# EAGLE design H1DR10 (EAGLE 9.5.1)

## Sheet 1 of 2
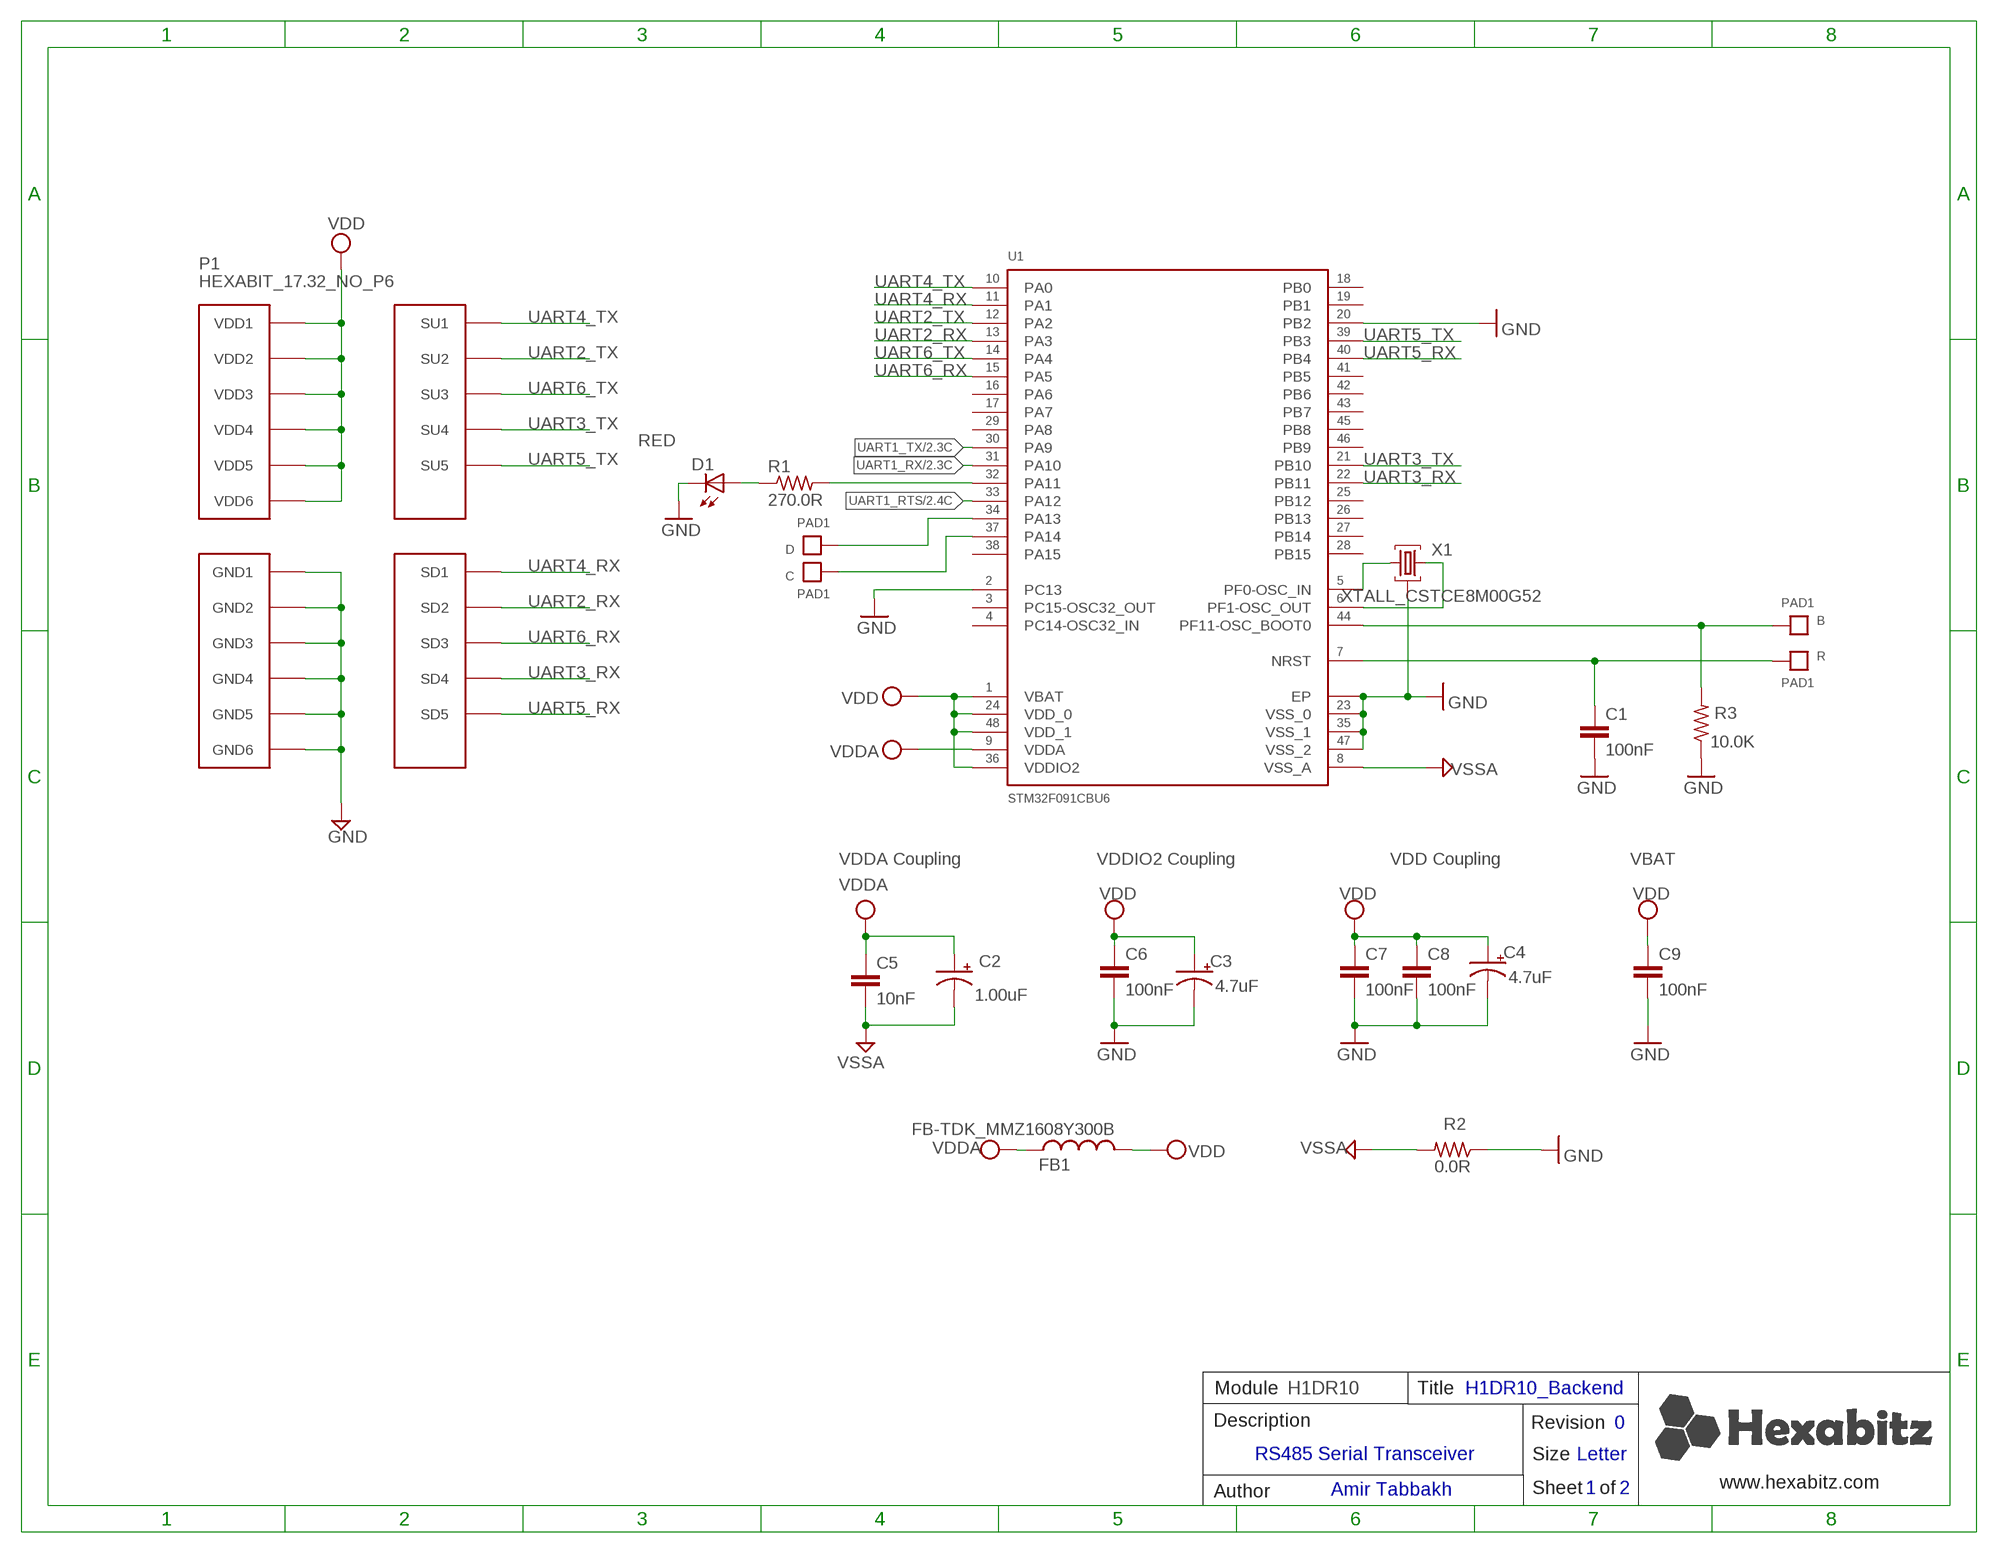
[diagram p0: schematic, sheet 1]

### Parts
B  PAD1  [PAD1]
C  PAD1  [PAD1]
C1  100nF  C-0603  [C-0603]
C2  1.00uF  C-0805-POL  [C-0805-POL]
C3  4.7uF  C-0805-POL  [C-0805-POL]
C4  4.7uF  C-0805-POL  [C-0805-POL]
C5  10nF  C-0603  [C-0603]
C6  100nF  C-0603  [C-0603]
C7  100nF  C-0603  [C-0603]
C8  100nF  C-0603  [C-0603]
C9  100nF  C-0603  [C-0603]
D  PAD1  [PAD1]
D1  RED  VLMS1300-GS08  [VLMS1300-GS08]
FB1  FB-TDK_MMZ1608Y300B  [FB-TDK_MMZ1608Y300B]
P1  HEXABIT_17.32_NO_P6  [HEXABIT_17.32_NO_P6]
R  PAD1  [PAD1]
R1  270.0R  R-0603  [R-0603]
R2  0.0R  R-0603  [R-0603]
R3  10.0K  R-0603  [R-0603]
U1  STM32F091CBU6  [STM32F091CBU6]
X1  XTALL_CSTCE8M00G52  [XTALL_CSTCE8M00G52]

### Nets
B1: B.P$1 B.P$2 R3.2 U1.P$44(PF11-OSC_BOOT0)
GND: C1.2 C3.2(-) C4.2(-) C6.2 C7.2 C8.2 C9.2 D1.C P1.PAD_PD7(GND1) P1.PAD_PD8(GND2) P1.PAD_PD9(GND3) P1.PAD_PD10(GND4) P1.PAD_PD11(GND5) P1.PAD_PD12(GND6) R2.1 R3.1 U1.EP U1.P$2(PC13) U1.P$20(PB2) U1.P$23(VSS_0) U1.P$35(VSS_1) U1.P$47(VSS_2) X1.P$2 ; also sheet 2
N$1: D.P$1 D.P$2 U1.P$34(PA13)
N$3: R1.2 U1.P$32(PA11)
N$4: D1.A R1.1
N$5: U1.P$5(PF0-OSC_IN) X1.P$1
N$6: U1.P$6(PF1-OSC_OUT) X1.P$3
N$9: C.P$1 C.P$2 U1.P$37(PA14)
R1: C1.1 R.P$1 R.P$2 U1.P$7(NRST)
UART1_RTS: U1.P$33(PA12) ; also sheet 2
UART1_RX: U1.P$31(PA10) ; also sheet 2
UART1_TX: U1.P$30(PA9) ; also sheet 2
UART2_RX: P1.PAD_PD2(SD2) U1.P$13(PA3)
UART2_TX: P1.PAD_PU2(SU2) U1.P$12(PA2)
UART3_RX: P1.PAD_PD4(SD4) U1.P$22(PB11)
UART3_TX: P1.PAD_PU4(SU4) U1.P$21(PB10)
UART4_RX: P1.PAD_PD1(SD1) U1.P$11(PA1)
UART4_TX: P1.PAD_PU1(SU1) U1.P$10(PA0)
UART5_RX: P1.PAD_PD5(SD5) U1.P$40(PB4)
UART5_TX: P1.PAD_PU5(SU5) U1.P$39(PB3)
UART6_RX: P1.PAD_PD3(SD3) U1.P$15(PA5)
UART6_TX: P1.PAD_PU3(SU3) U1.P$14(PA4)
VDD: C3.1(+) C4.1(+) C6.1 C7.1 C8.1 C9.1 FB1.2 P1.PAD_PU7(VDD1) P1.PAD_PU8(VDD2) P1.PAD_PU9(VDD3) P1.PAD_PU10(VDD4) P1.PAD_PU11(VDD5) P1.PAD_PU12(VDD6) U1.P$1(VBAT) U1.P$24(VDD_0) U1.P$36(VDDIO2) U1.P$48(VDD_1) ; also sheet 2
VDDA: C2.1(+) C5.1 FB1.1 U1.P$9(VDDA)
VSSA: C2.2(-) C5.2 R2.2 U1.P$8(VSS_A)
Unconnected: U1.P$3(PC14-OSC32_IN) U1.P$4(PC15-OSC32_OUT) U1.P$16(PA6) U1.P$17(PA7) U1.P$18(PB0) U1.P$19(PB1) U1.P$25(PB12) U1.P$26(PB13) U1.P$27(PB14) U1.P$28(PB15) U1.P$29(PA8) U1.P$38(PA15) U1.P$41(PB5) U1.P$42(PB6) U1.P$43(PB7) U1.P$45(PB8) U1.P$46(PB9)

### Notes on the sheet
- VDDA Coupling | VDDIO2 Coupling | VDD Coupling | VBAT
- Module | H1DR10 | Title | H1DR10_Backend
- Description | Revision | 0
- RS485 Serial Transceiver
- Size | Letter
- Amir Tabbakh | www.hexabitz.com
- Author | Sheet   of | 1 | 2
- C:/Users/Admin/Desktop/logodraft.bmp

## Sheet 2 of 2
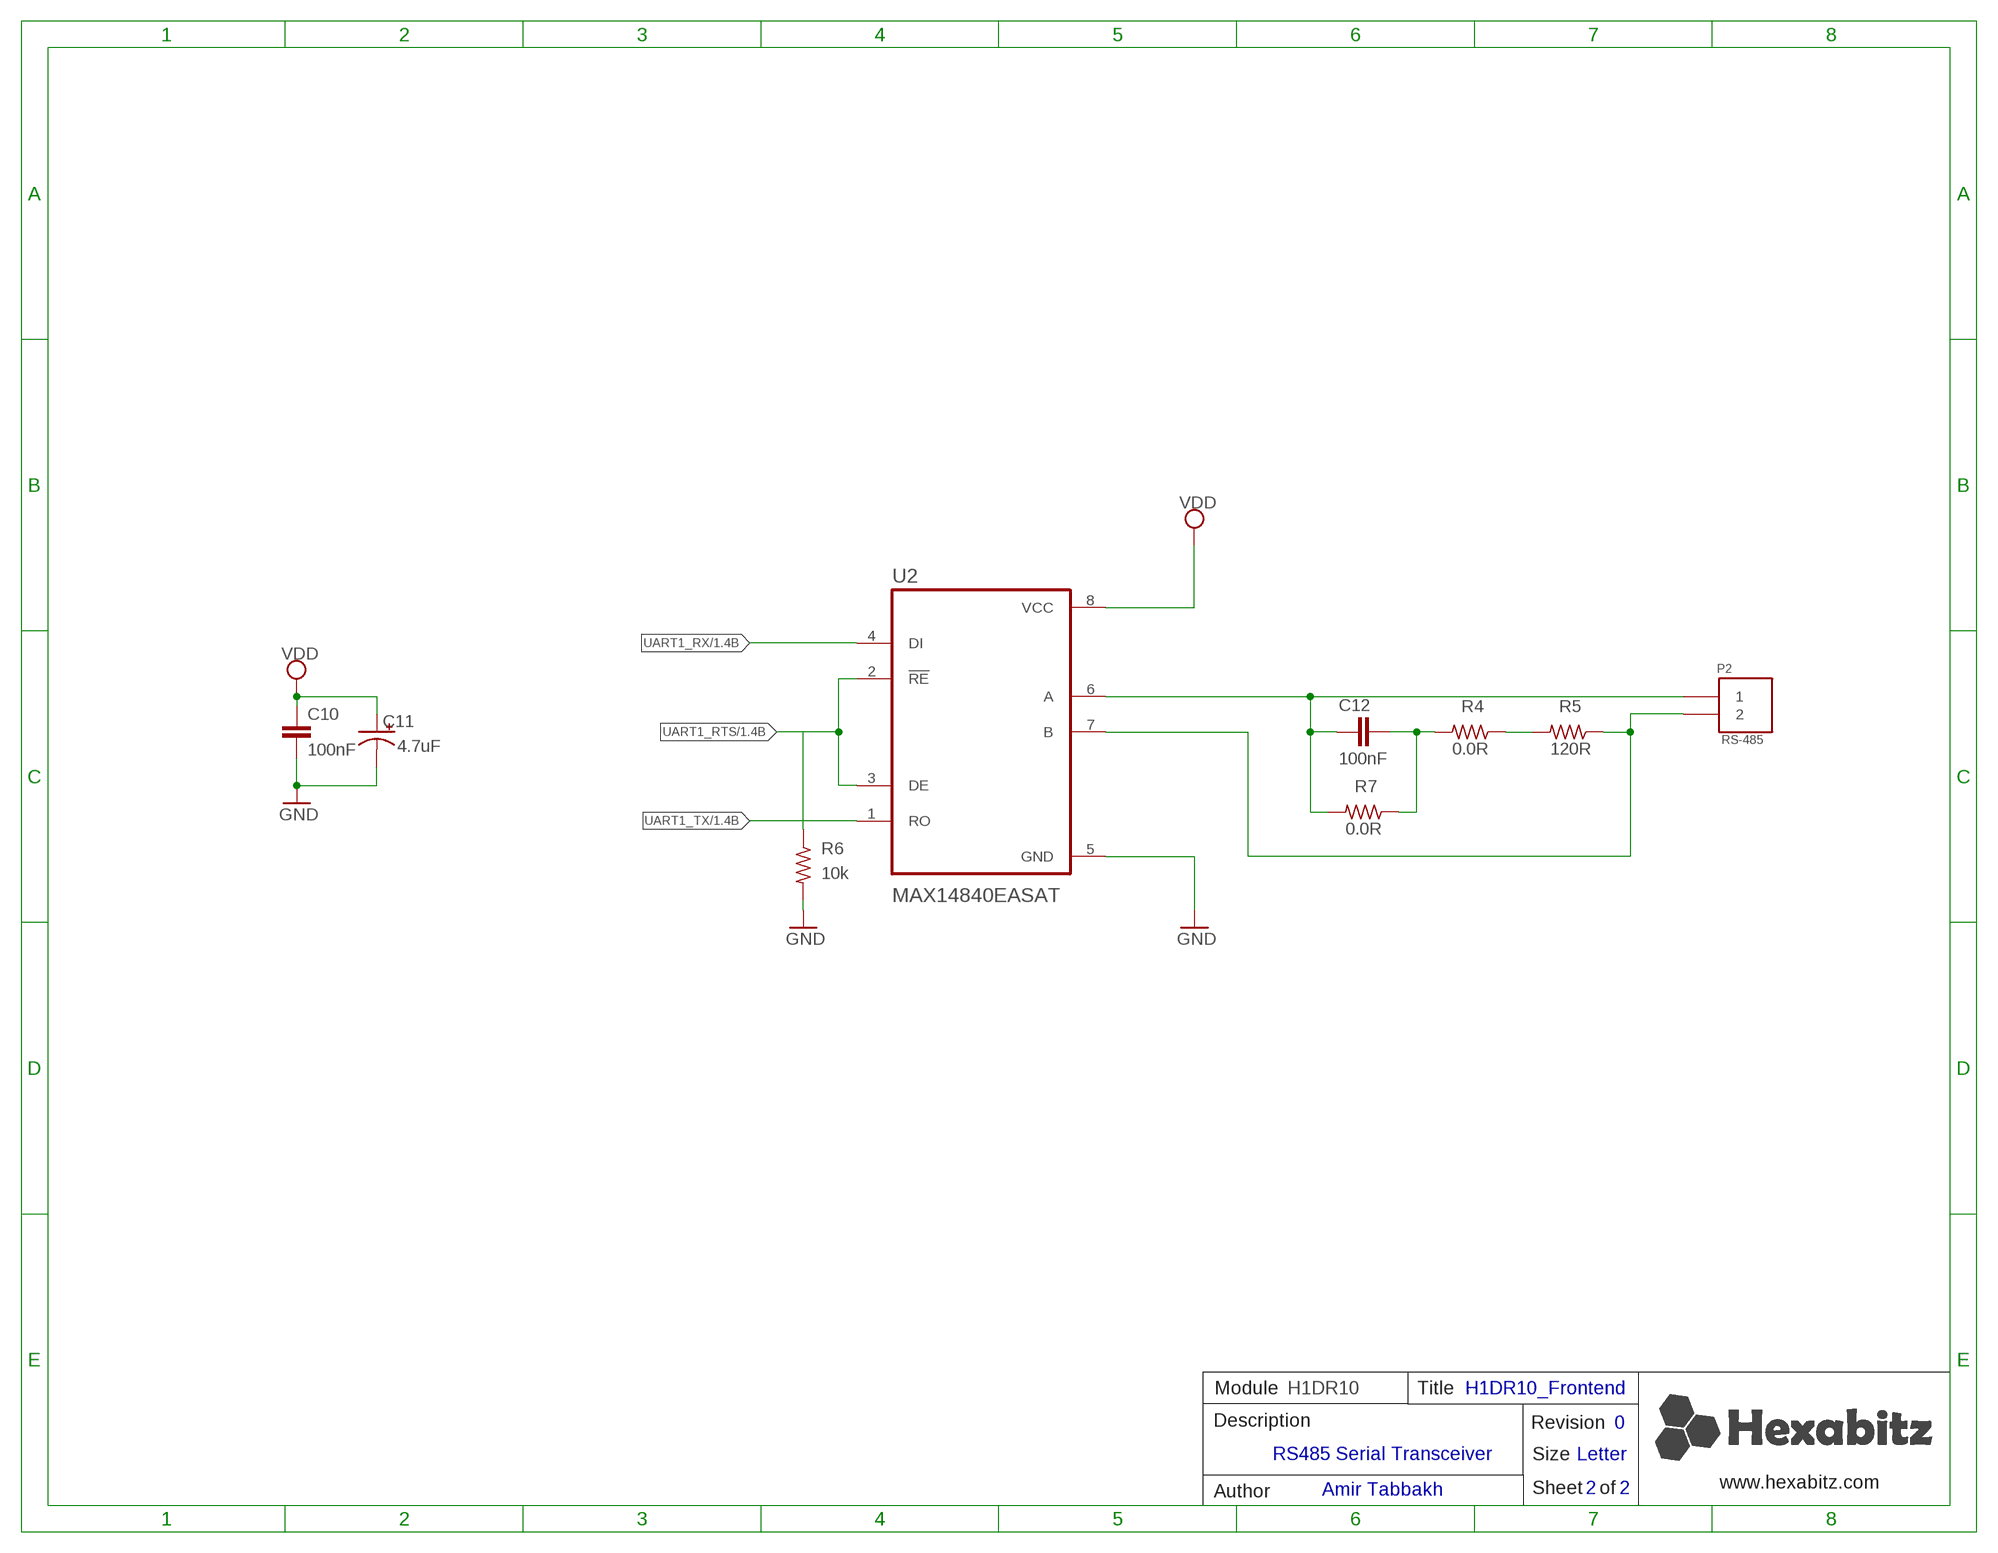
[diagram p1: schematic, sheet 2]

### Parts
C10  100nF  C-0603  [C-0603]
C11  4.7uF  C-0805-POL  [C-0805-POL]
C12  100nF  C-0603  [C-0603]
P2  RS-485  1546111-2  [1546111-2]
R4  0.0R  R-0603  [R-0603]
R5  120R  R-0805  [R-0805]
R6  10k  R-0603  [R-0603]
R7  0.0R  R-0603  [R-0603]
U2  MAX14840EASAT  [SOIC127P600X175-8N]

### Nets
GND: C10.2 C11.2(-) R6.2 U2.5(GND) ; also sheet 1
N$2: C12.2 R4.2 R7.1
N$7: P2.2 R5.1 U2.7(B)
N$8: C12.1 P2.1 R7.2 U2.6(A)
N$10: R4.1 R5.2
UART1_RTS: R6.1 U2.2(!RE) U2.3(DE) ; also sheet 1
UART1_RX: U2.4(DI) ; also sheet 1
UART1_TX: U2.1(RO) ; also sheet 1
VDD: C10.1 C11.1(+) U2.8(VCC) ; also sheet 1

### Notes on the sheet
- Module | H1DR10 | Title | H1DR10_Frontend
- Description | Revision | 0
- RS485 Serial Transceiver
- Size | Letter
- Amir Tabbakh | www.hexabitz.com
- Author | Sheet   of | 2 | 2

## Library data of the parts
B C D R = Hexabitz:PAD1
C1 C6 C8 C10 = Hexabitz:C-0603: CAP CER 10% X7R 0603; CAPACITANCE: 100nF; MFN: KEMET; MPN: C0603C104K8RACTU; OCTOPART_URL: https://octopart.com/c0603c104k8ractu-kemet-145075?r=sp&s=9bS9ASSwSEqMCE9KBEQZ0g; TOLERANCE: 10%; VOLTAGE_RATING: 10V
C2 = Hexabitz:C-0805-POL: Cap Tant Solid SMD 2012; CAPACITANCE: 1.00uF; MFN: Yageo; MPN: CC0805KKX7R7BB105; OCTOPART_URL: https://octopart.com/cc0805kkx7r7bb105-yageo-8376555?r=sp&s=YKl1wwtkROau_X5nniH2ig; TOLERANCE: 10%; VOLTAGE_RATING: 16V
C3 C4 C11 = Hexabitz:C-0805-POL: Cap Tant Solid SMD 2012; CAPACITANCE: 4.7uF; MFN: Murata; MPN: GRM21BC81E475KA12L; OCTOPART_URL: https://octopart.com/grm21bc81e475ka12l-murata-10331911?r=sp&s=RY3qZSD8T6mG6TC9CHI5qQ; TOLERANCE: 10%; VOLTAGE_RATING: 25V
C5 = Hexabitz:C-0603: CAP CER 10% X7R 0603; CAPACITANCE: 10nF; MFN: KEMET; MPN: C0603C103K5RACTU; OCTOPART_URL: https://octopart.com/c0603c103k5ractu-kemet-133094?r=sp&s=R_iPBxLnSmGqhkU2rIMFpg; TOLERANCE: 10%; VOLTAGE_RATING: 50V
C7 = Hexabitz:C-0603: CAP CER 10% X7R 0603; CAPACITANCE: 100nF; MFN: KEMET; MPN: C0603C104K8RACTU; OCTOPART_URL: https://octopart.com/c0603c104k8ractu-kemet-145075?r=sp&s=9bS9ASSwSEqMCE9KBEQZ0g; TOLERANCE: 10%; VOLTAGE_RATING: 10
C9 = Hexabitz:C-0603: CAP CER 10% X7R 0603; CAPACITANCE: 100nF; MFN: KEMET; MPN: C0603C104K8RACTU; OCTOPART_URL: https://octopart.com/c0603c104k8ractu-kemet-145075?r=sp&s=9bS9ASSwSEqMCE9KBEQZ0g; TOLERANCE: 10V; VOLTAGE_RATING: 10%
C12 = Hexabitz:C-0603: CAP CER 10% X7R 0603; CAPACITANCE: 100nF; MFN: AVX; MPN: 0603YC104K4T2A; OCTOPART_URL: https://octopart.com/0603yc104k4t2a-avx+interconnect+%2F+elco-8120651; TOLERANCE: 10%; VOLTAGE_RATING: 16V
D1 = Hexabitz:VLMS1300-GS08: Red 0603 130° Clear 54 mcd 2 V Surface Mount ChipLED ; Octopart Url : http://octopart.com/vlms1300-gs08-vishay-21709201; MFN: Vishay; MPN: VLMS1300-GS08; OCTOPART_URL: https://octopart.com/vlms1300-gs08-vishay-21709201?r=sp&s=_gcP4_q8T1SC6PJQPTQ9yA
FB1 = Hexabitz:FB-TDK_MMZ1608Y300B: Ferrite Beads Multi-Layer 30Ohm 25% 100MHz 1.5A 50mOhm DCR 0603; MFN: TDK; MPN: MMZ1608Y300B; OCTOPART_URL: https://octopart.com/mmz1608y300b-tdk-368280?r=sp&s=cd9_2ZEqQ9q9UNBuQgHAiA
P1 = hexabitz_connectors:HEXABIT_?_NO_P6: Hexabitz Hexagon Module Connector Hexagon side length = 17.32mm. The following ports are removed: P6
P2 = Hexabitz:1546111-2: Conn Shrouded Header HDR 2 POS 5.08mm Solder ST Thru-Hole; MFN: TE Connectivity; MPN: 1546111-2; OCTOPART_URL: https://octopart.com/1546111-2-te+connectivity-40393355
R1 = Hexabitz:R-0603: Thick Film Resistors - SMD 0603; MFN: Yageo; MPN: RC0603FR-07270RL; OCTOPART_URL: https://octopart.com/search?q=RC0603FR-07270RL&start=0; RESISTANCE: 270.0 Ohm; TOLERANCE: 1%
R2 = Hexabitz:R-0603: Thick Film Resistors - SMD 0603; MFN: Yageo; MPN: RC0603JR-070RL; OCTOPART_URL: https://octopart.com/rc0603jr-070rl-yageo-1241539?r=sp&s=X2NteqRjRNWrnx42Y0aliA; RESISTANCE: 0.0 Ohm
R3 = Hexabitz:R-0603: Thick Film Resistors - SMD 0603; MFN: Yageo; MPN: RC0603JR-0710KL; OCTOPART_URL: https://octopart.com/search?q=RC0603JR-0710KL&start=0; RESISTANCE: 10.0K Ohm; TOLERANCE: 5%
R4 R7 = Hexabitz:R-0603: Thick Film Resistors - SMD 0603; MFN: Vishay; MPN: CRCW06030000Z0EA; OCTOPART_URL: https://octopart.com/crcw06030000z0ea-vishay-39556096#; RESISTANCE: 0.0 Ohm
R5 = Hexabitz:R-0805: Thick Film Resistors - SMD 0605; MFN: Panasonic; MPN: ERJP6WF1200V; OCTOPART_URL: https://octopart.com/erjp6wf1200v-panasonic-25949195?r=sp#; POWER_DISSIPATION: 0.5W; RESISTANCE: 120R; TOLERANCE: 1%
R6 = Hexabitz:R-0603: Thick Film Resistors - SMD 0603; MFN: Vishay; MPN: CRCW060310K0JNEB; OCTOPART_URL: https://octopart.com/crcw060310k0jneb-vishay+dale-46603268; RESISTANCE: 10k; TOLERANCE: 5%
U1 = Hexabitz:STM32F091CBU6: Description : ARM-based 32-bit MCU, CAN, 12 timers, ADC, DAC & Comm. Interface, 2 to 3.6 V, -40 to 85 degC, 48-Pin UFQFPN, RoHS, Tray ;Parameter : Ciiva URL : https://ciiva.com/part/STM32F091CBU6-20240708, CiivaID : 20240708, Clock Speed : 48000000.0 Hz, Lifecycle Status : Active, Mounting Style : Surface Mount, Number of Pins : 48, Octopart Url : https://octopart.com/stm32f091cbu6-stmicroelectronics-51988677, OctopartID : 5f4f955c32ec8088, RAM Memory Size : 32768 B, REACH SVHC Compliance : No SVHC, RoHS : Compliant,; MFN: STMicroelectronics; MPN: STM32F091CBU6; OCTOPART_URL: https://octopart.com/stm32f091cbu6-stmicroelectronics-51988677?r=sp&s=bU6fpgsrTZOxHyt7jkfh3w
U2 = Hexabitz:MAX14840EASAT; DESCRIPTION: 1/1 Transceiver Half RS422, RS485 8-SOIC; MFN: Maxim Integrated; MPN: MAX14840EASA+; OCTOPART_URL: https://octopart.com/max14840easa%2B-maxim+integrated-42876696?r=sp#
X1 = Hexabitz:XTALL_CSTCE8M00G52: MURATA CSTCE8M00G52-R0 RESONATOR, SMD, 8MHZ ; Octopart Url : https://octopart.com/cstce8m00g52-r0-murata-7145559; MFN: Murata; MPN: CSTCE8M00G52Z-R0; OCTOPART_URL: https://octopart.com/cstce8m00g52z-r0-murata-17755941?r=sp&s=JDnNJnrHQhyS8Zk4ofFWXw

## Board
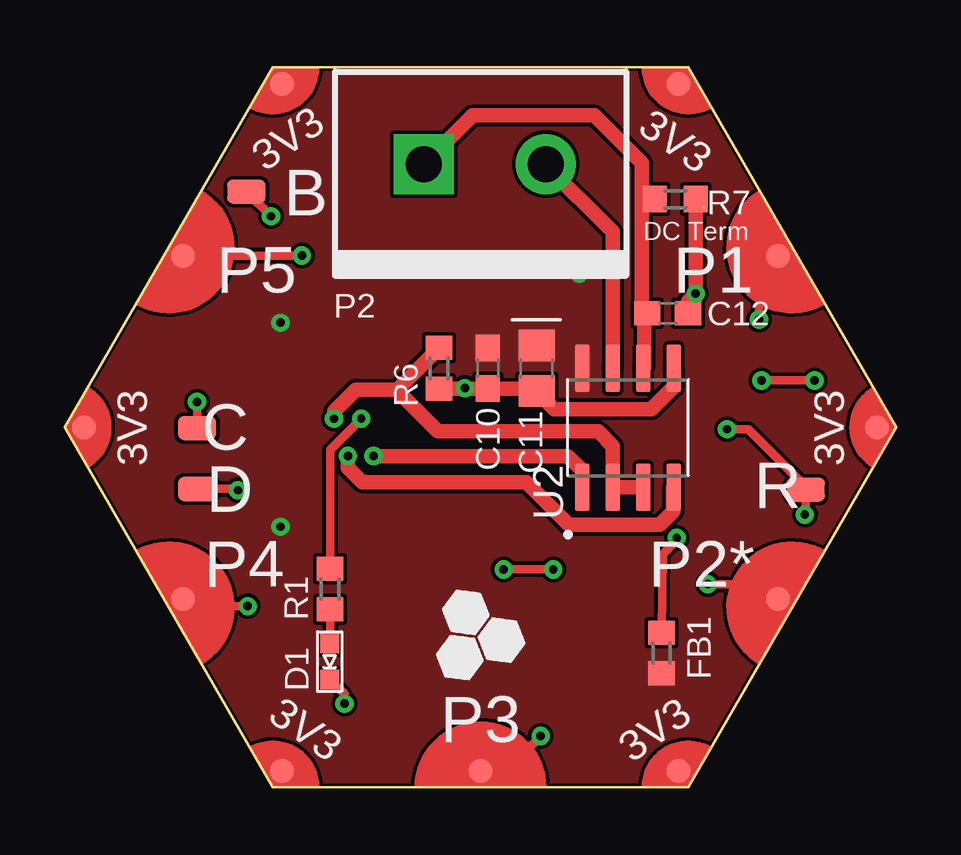
[diagram p2: board, top side]
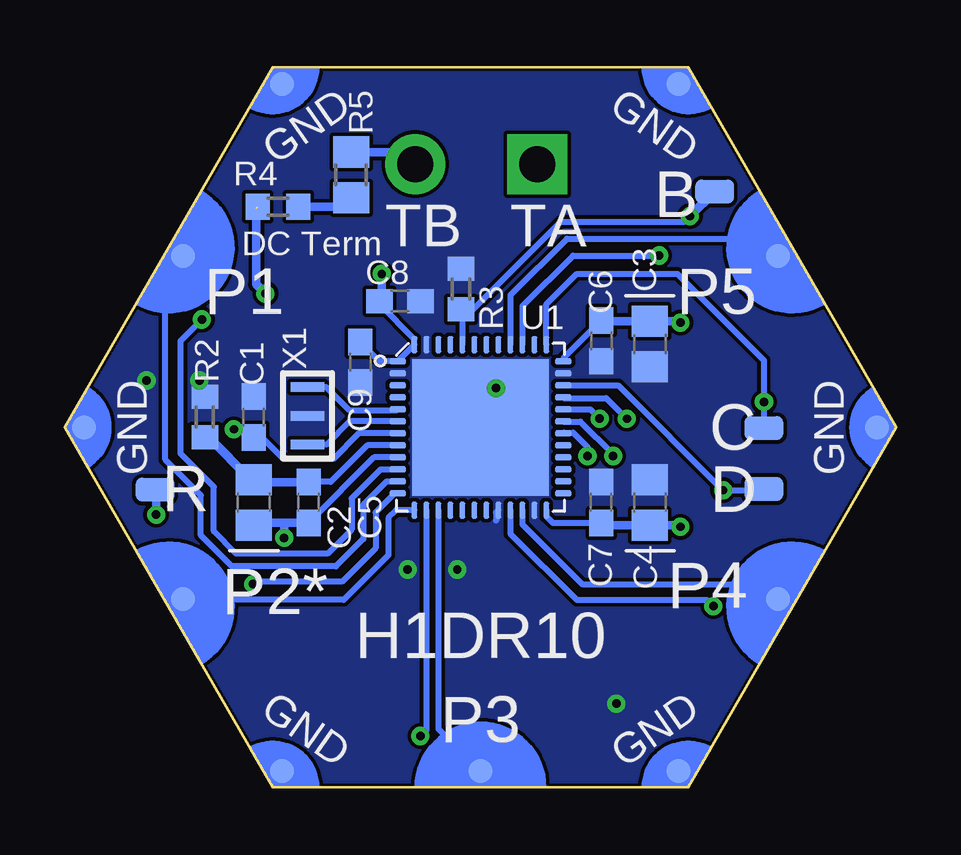
[diagram p3: board, bottom side, seen from below]

Size 34.64 x 30 mm. Coordinates in mm from the lower left corner, seen from the top.
Copper layers (1*16): Top 0.035mm / dielectric 1.5mm / Bottom 0.035mm
Design rules "2_layer": minimum track width 7mil, minimum drill 10mil, track to track 6mil, track to pad 6mil, pad to pad 6mil, via to via 6mil, smd to smd 0mil, copper to edge 1mil, drill to drill 8mil, minimum pad ring 10mil, minimum via ring 8mil, stop-mask expansion 2mil, vias tented up to drill 15mil, thermal gap 10mil

### Footprints (pad centres in the part's own frame; a part is rotated, then mirrored left to right if it is on the bottom)
PAD1 = smd 1.6 x 1: P$1 0,0 | smd 1.6 x 1 bottom: P$2 0,0
C-0603 = smd 1.1 x 1: 1 -0.85,0; 2 0.85,0
C-0805-POL = smd 1.3 x 1.5: 1 -0.95,0; 2 0.95,0
VLMS1300-GS08 = smd 0.8 x 0.8: A 0,0.75; C 0,-0.75
FB-TDK_MMZ1608Y300B = smd 1 x 1.1: 1 -0.85,0; 2 0.85,0
HEXABIT_17.32_NO_P6 = smd 1 x 1 bottom: PAD_PD1 12.39,7.15; PAD_PD2 12.39,-7.15; PAD_PD3 0,-14.31; PAD_PD4 -12.39,-7.15; PAD_PD5 -12.39,7.15; PAD_PD7 8.26,14.31; PAD_PD8 16.52,0; PAD_PD9 8.26,-14.31; PAD_PD10 -8.26,-14.31; PAD_PD11 -16.52,0; PAD_PD12 -8.26,14.31 | smd 1 x 1: PAD_PU1 12.39,7.15; PAD_PU2 12.39,-7.15; PAD_PU3 0,-14.31; PAD_PU4 -12.39,-7.15; PAD_PU5 -12.39,7.15; PAD_PU7 8.26,14.31; PAD_PU8 16.52,0; PAD_PU9 8.26,-14.31; PAD_PU10 -8.26,-14.31; PAD_PU11 -16.52,0; PAD_PU12 -8.26,14.31
1546111-2 = drill 1.5 pad 2.5 square: 1 -2.54,0 | drill 1.5 pad 2.5: 2 2.54,0
R-0603 = smd 1 x 1.1: 1 -0.85,0; 2 0.85,0
R-0805 = smd 1.3 x 1.5: 1 -0.95,0; 2 0.95,0
STM32F091CBU6 = smd 5.7 x 5.7: EP 0,0 | smd 0.25 x 0.7: P$1 -2.75,-3.45; P$2 -2.25,-3.45; P$3 -1.75,-3.45; P$4 -1.25,-3.45; P$5 -0.75,-3.45; P$6 -0.25,-3.45; P$7 0.25,-3.45; P$8 0.75,-3.45; P$9 1.25,-3.45; P$10 1.75,-3.45; P$11 2.25,-3.45; P$12 2.75,-3.45; P$25 2.75,3.45; P$26 2.25,3.45; P$27 1.75,3.45; P$28 1.25,3.45; P$29 0.75,3.45; P$30 0.25,3.45; P$31 -0.25,3.45; P$32 -0.75,3.45; P$33 -1.25,3.45; P$34 -1.75,3.45; P$35 -2.25,3.45; P$36 -2.75,3.45 | smd 0.7 x 0.25: P$13 3.45,-2.75; P$14 3.45,-2.25; P$15 3.45,-1.75; P$16 3.45,-1.25; P$17 3.45,-0.75; P$18 3.45,-0.25; P$19 3.45,0.25; P$20 3.45,0.75; P$21 3.45,1.25; P$22 3.45,1.75; P$23 3.45,2.25; P$24 3.45,2.75; P$37 -3.45,2.75; P$38 -3.45,2.25; P$39 -3.45,1.75; P$40 -3.45,1.25; P$41 -3.45,0.75; P$42 -3.45,0.25; P$43 -3.45,-0.25; P$44 -3.45,-0.75; P$45 -3.45,-1.25; P$46 -3.45,-1.75; P$47 -3.45,-2.25; P$48 -3.45,-2.75
SOIC127P600X175-8N = smd 1.97 x 0.59: 1 -2.475,1.905; 2 -2.475,0.635; 3 -2.475,-0.635; 4 -2.475,-1.905; 5 2.475,-1.905; 6 2.475,-0.635; 7 2.475,0.635; 8 2.475,1.905
XTALL_CSTCE8M00G52 = smd 1.4 x 0.4: P$1 0,1.2; P$2 0,0; P$3 0,-1.2

### Placement (x,y rotation side)
B  7.57,24.83 0 top
C  5.51,14.97 0 top
C1  26.77,15.43 90 bottom
C2  26.77,11.88 90 bottom
C3  10.26,18.48 270 bottom
C4  10.26,11.88 90 bottom
C5  24.48,11.88 90 bottom
C6  12.29,18.61 270 bottom
C7  12.29,11.88 90 bottom
C8  20.67,20.26 0 bottom
C9  22.32,17.72 270 bottom
C10  17.62,17.46 270 top
C11  19.66,17.46 270 top
C12  25.12,19.75 0 top
D  5.51,12.43 180 top
D1  11.04,5.24 0 top
FB1  24.87,5.6 270 top
P1  17.32,15 0 top
P2  17.5,25.97 0 top
R  30.87,12.4 0 top
R1  11.05,8.27 90 top
R2  28.8,15.43 270 bottom
R3  18.13,20.77 270 bottom
R4  25.75,24.19 180 bottom
R5  22.7,25.53 270 bottom
R6  15.59,17.46 270 top
R7  25.44,24.51 180 top
U1  17.32,15 270 bottom
U2  23.47,14.99 90 top
X1  24.53,15.48 0 bottom

### Tracks (layer width: path | path; a pad name or v marks a point on that pad's centre or on a via)
B1  (via drill 0.35)
  Top 0.356: B.P$1 v8.59,23.8
  Bottom 0.254: U1.P$44 18.07,19.85 R3.2 17.62,19.92 13.98,23.56 8.84,23.56 v8.59,23.8
  Bottom 0.356: v8.59,23.8 B.P$1
GND  (via drill 0.35)
  Top 0.356: D1.C 11.66,3.88 v11.66,3.49 | v20.35,9.08 v18.29,9.08 | v29.03,16.96 v31.24,16.96 | 19.56,16.61 C11.2 | 16.7,16.61 v16.67,16.64
  Top 0.61: 19.56,16.61 C10.2 16.7,16.61 R6.2 | U2.5 25.37,16.7 24.44,15.77 20.4,15.77 C11.2
  Bottom 0.254: U1.P$20 16.67,11.45 16.67,11.12 | R2.1 29.03,16.51 v29.03,16.96
  pour Bottom (isolate 0.102, no thermals): 8.66,0 25.98,0 34.64,15 25.98,30 8.66,30 0,15
N$1  (via drill 0.35)
  Top 0.356: D.P$2 7.21,12.43 v7.21,12.38
  Bottom 0.254: U1.P$34 11.59,16.75 v7.22,12.38 v7.21,12.38 5.56,12.38 D.P$2
N$2  (via drill 0.35)  (1 unrouted)
  Top 0.61: C12.2 25.97,20.26 v26.29,20.58 R7.1
  Bottom 0.356: 26.67,24.13 26.67,20.96 v26.29,20.58
N$3  (via drill 0.35)
  Top 0.356: R1.2 11.05,14.07 v12.35,15.37
  Bottom 0.254: U1.P$32 12.74,15.75 v12.35,15.37
N$4
  Top 0.356: R1.1 11.05,6.01 D1.A
N$5
  Bottom 0.254: U1.P$5 20.8,15.72 22.79,15.72 23.75,16.68 X1.P$1
N$6
  Bottom 0.254: U1.P$6 22.76,15.25 23.73,14.28 X1.P$3
N$7
  Top 0.61: U2.7 22.82,17.47 22.82,23.15 20.01,25.96 20.02,25.97 P2.2
  Bottom 0.356: R5.1 20.54,26.48 P2.2
N$8
  Top 0.61: U2.6 24.14,17.5 24.14,19.62 C12.1 24.05,19.97 24.05,24.48 | 24.05,24.54 24.05,26.03 22.07,28 16.99,28 P2.1 | 24.05,24.54 24.05,24.48 | 24.05,24.48 24.56,24.48 R7.2 24.08,24.51 24.05,24.54
N$9  (via drill 0.35)
  Top 0.356: C.P$2 v5.51,16.07
  Bottom 0.254: U1.P$37 14.57,20.14 13.31,21.4 9.12,21.4 5.51,17.79 v5.51,16.07 C.P$2
N$10
  Bottom 0.356: 22.86,24.42 R5.2 23.09,24.19 R4.1
R1  (via drill 0.35)
  Top 0.254: 30.87,12.53 R.P$1
  Top 0.356: v27.59,14.92 28.48,14.92 30.87,12.53 | R.P$1 30.87,11.41 v30.83,11.37
  Bottom 0.254: U1.P$7 22.38,14.75 23.46,13.67 25.52,13.67 26.77,14.92 | 26.77,14.92 v27.59,14.92 | C1.1 26.77,14.92
  Bottom 0.356: v30.83,11.37 30.83,12.36 R.P$1
UART1_RTS  (via drill 0.35)
  Top 0.61: U2.3 U2.2 22.83,14.23 22.22,14.83 15.55,14.83 13.81,16.57 | v11.22,15.36 11.22,15.67 12.13,16.57 13.81,16.57 | R6.1 13.85,16.57 13.81,16.57
  Bottom 0.254: U1.P$33 13.84,16.22 12.09,16.22 v11.23,15.36 v11.22,15.36
UART1_RX  (via drill 0.35)
  Top 0.61: v11.79,13.81 11.79,13.31 12.39,12.72 19.22,12.72 20.99,10.94 24.8,10.94 25.36,11.51 U2.4
  Bottom 0.254: U1.P$31 13.16,15.24 11.79,13.88 v11.79,13.81
UART1_TX  (via drill 0.35)
  Top 0.61: v12.86,13.81 20.97,13.81 21.56,13.21 U2.1
  Bottom 0.254: U1.P$30 13.84,14.78 13.46,14.78 12.86,14.19 v12.86,13.81
UART2_RX
  Bottom 0.254: U1.P$13 20.83,11.55 21.16,11.23 21.16,9.68 23.02,7.81 27.91,7.81
  Bottom 0.356: 27.91,7.81 27.95,7.85 P1.PAD_PD2
UART2_TX  (via drill 0.35)
  Top 0.356: v26.79,8.47 29.22,8.47 29.71,7.98 P1.PAD_PU2
  Bottom 0.254: U1.P$12 20.9,12.25 21.69,11.46 21.69,9.97 23.09,8.57 26.69,8.57 v26.79,8.47
UART3_RX
  Bottom 0.254: U1.P$22 15.57,10.96 13.05,8.45 5.05,8.45
  Bottom 0.356: P1.PAD_PD4 4.93,8.32 5.05,8.45
UART3_TX  (via drill 0.35)
  Top 0.254: 5.31,8.19 5.94,7.56
  Top 0.356: v7.62,7.56 5.94,7.56 | P1.PAD_PU4 5.27,8.19 5.31,8.19
  Bottom 0.254: U1.P$21 16.07,10.57 13.3,7.81 7.87,7.81 v7.62,7.56
UART4_RX
  Bottom 0.254: U1.P$11 21.23,12.75 22.2,11.78 22.2,10.35 23.34,9.21 27.68,9.21 28.97,10.5 28.97,12.17 30.45,13.65 30.45,21.41 P1.PAD_PD1
UART4_TX  (via drill 0.35)
  Top 0.254: 28.93,21.37 P1.PAD_PU1
  Top 0.356: v28.93,19.5 28.93,21.37
  Bottom 0.254: U1.P$10 21.48,13.25 22.69,12.05 22.69,10.74 23.69,9.74 27.51,9.74 28.43,10.67 28.43,12.52 29.82,13.91 29.82,18.61 v28.93,19.5
UART5_RX
  Bottom 0.254: U1.P$40 16.07,20.51 13.71,22.87 5.63,22.87 4.93,22.17 P1.PAD_PD5
UART5_TX  (via drill 0.35)
  Top 0.356: P1.PAD_PU5 4.94,22.16 v9.88,22.16
  Bottom 0.254: U1.P$39 15.57,20.05 13.46,22.16 v9.88,22.16
UART6_RX
  Bottom 0.254: U1.P$15 19.07,2.44 17.86,1.23
  Bottom 0.356: P1.PAD_PD3 17.86,1.23
UART6_TX  (via drill 0.35)
  Top 0.254: 19.15,1.46 17.75,1.46
  Top 0.356: v19.82,2.14 19.15,1.46 | 17.75,1.46 17.32,1.03 P1.PAD_PU3
  Bottom 0.254: U1.P$14 19.57,2.4 v19.82,2.14
VDD  (via drill 0.35)
  Bottom 0.254: U1.P$24 14.57,11.3 14.3,11.03 C7.1 | 21.52,20.13 20.07,18.68 U1.P$48 U1.P$1 21.53,17.75 22.32,18.54 C9.1 | U1.P$36 13.87,17.88 C6.1 | C8.1 21.43,20.26
  Bottom 0.356: C7.1 12.19,10.93 C4.1 9.05,10.93 v8.99,10.86 | 21.52,20.13 C8.1 | C6.1 12.26,19.43 C3.1 9.05,19.43 v8.99,19.37 | v21.43,21.4 21.43,20.26
  pour Top (isolate 0.102, no thermals): 8.66,0 25.98,0 34.64,15 25.98,30 8.66,30 0,15
VDDA  (via drill 0.35)
  Top 0.356: FB1.1 24.91,9.72 25.46,10.27 25.46,10.36 v25.5,10.4
  Bottom 0.254: U1.P$9 21.76,13.75 C5.1 | 26.67,11.03 C2.1
  Bottom 0.356: C5.1 25.5,11.03 | 25.5,11.03 26.67,11.03 | v25.5,10.4 25.5,11.03
VSSA
  Bottom 0.254: U1.P$8 22.04,14.25 23.56,12.73 C5.2 | C2.2 26.67,12.73
  Bottom 0.356: 26.67,12.73 C5.2 | C2.2 26.9,12.83 28.65,14.58 R2.2

### Text on the board
tPlace: 3V3 | 3V3 | P5 | P1 | 3V3 | 3V3 | P4 | P2* | 3V3 | P3 | 3V3
bPlace: GND | GND | P5 | P1 | GND | GND | P4 | P2* | H1DR10 | GND | P3 | GND
tNames: DC Term
bNames: B | TA | TB | DC Term | C | R | D